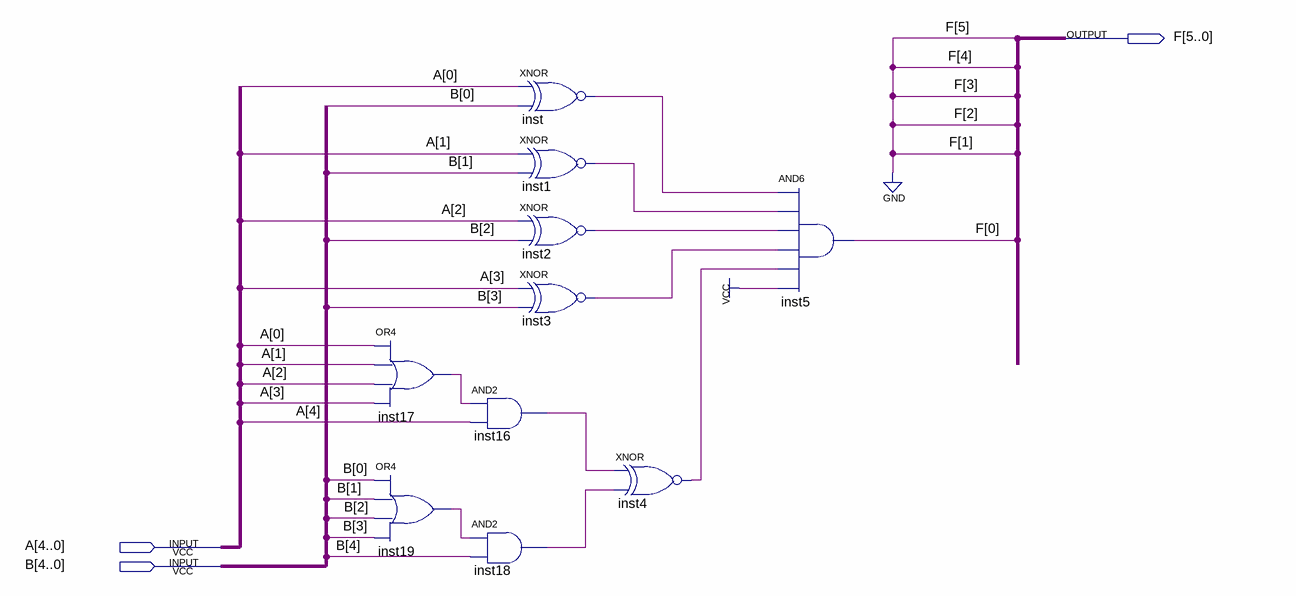
[diagram p0: schematic sheet]
// Quartus schematic eos_A_igual_B.bdf as structural Verilog: 10 symbols, 3 pins
module eos_A_igual_B (
  input  [4:0] A,
  input  [4:0] B,
  output [5:0] F
);

  wire inst1_out, inst2_out, inst3_out, inst4_out, inst16_out, inst17_out, inst18_out, inst19_out, inst_out;

  or inst17 (inst17_out, A[0], A[1], A[2], A[3]);
  or inst19 (inst19_out, B[0], B[1], B[2], B[3]);
  and inst16 (inst16_out, inst17_out, A[4]);
  and inst18 (inst18_out, inst19_out, B[4]);
  xnor inst (inst_out, A[0], B[0]);
  xnor inst1 (inst1_out, A[1], B[1]);
  xnor inst2 (inst2_out, A[2], B[2]);
  xnor inst3 (inst3_out, A[3], B[3]);
  xnor inst4 (inst4_out, inst16_out, inst18_out);
  and inst5 (F[0], inst_out, inst1_out, inst2_out, inst3_out, inst4_out, 1'b1);

  assign F[5:1] = {5{1'b0}};
endmodule
